# Altium schematic sheet MCU.SchDoc
size A2
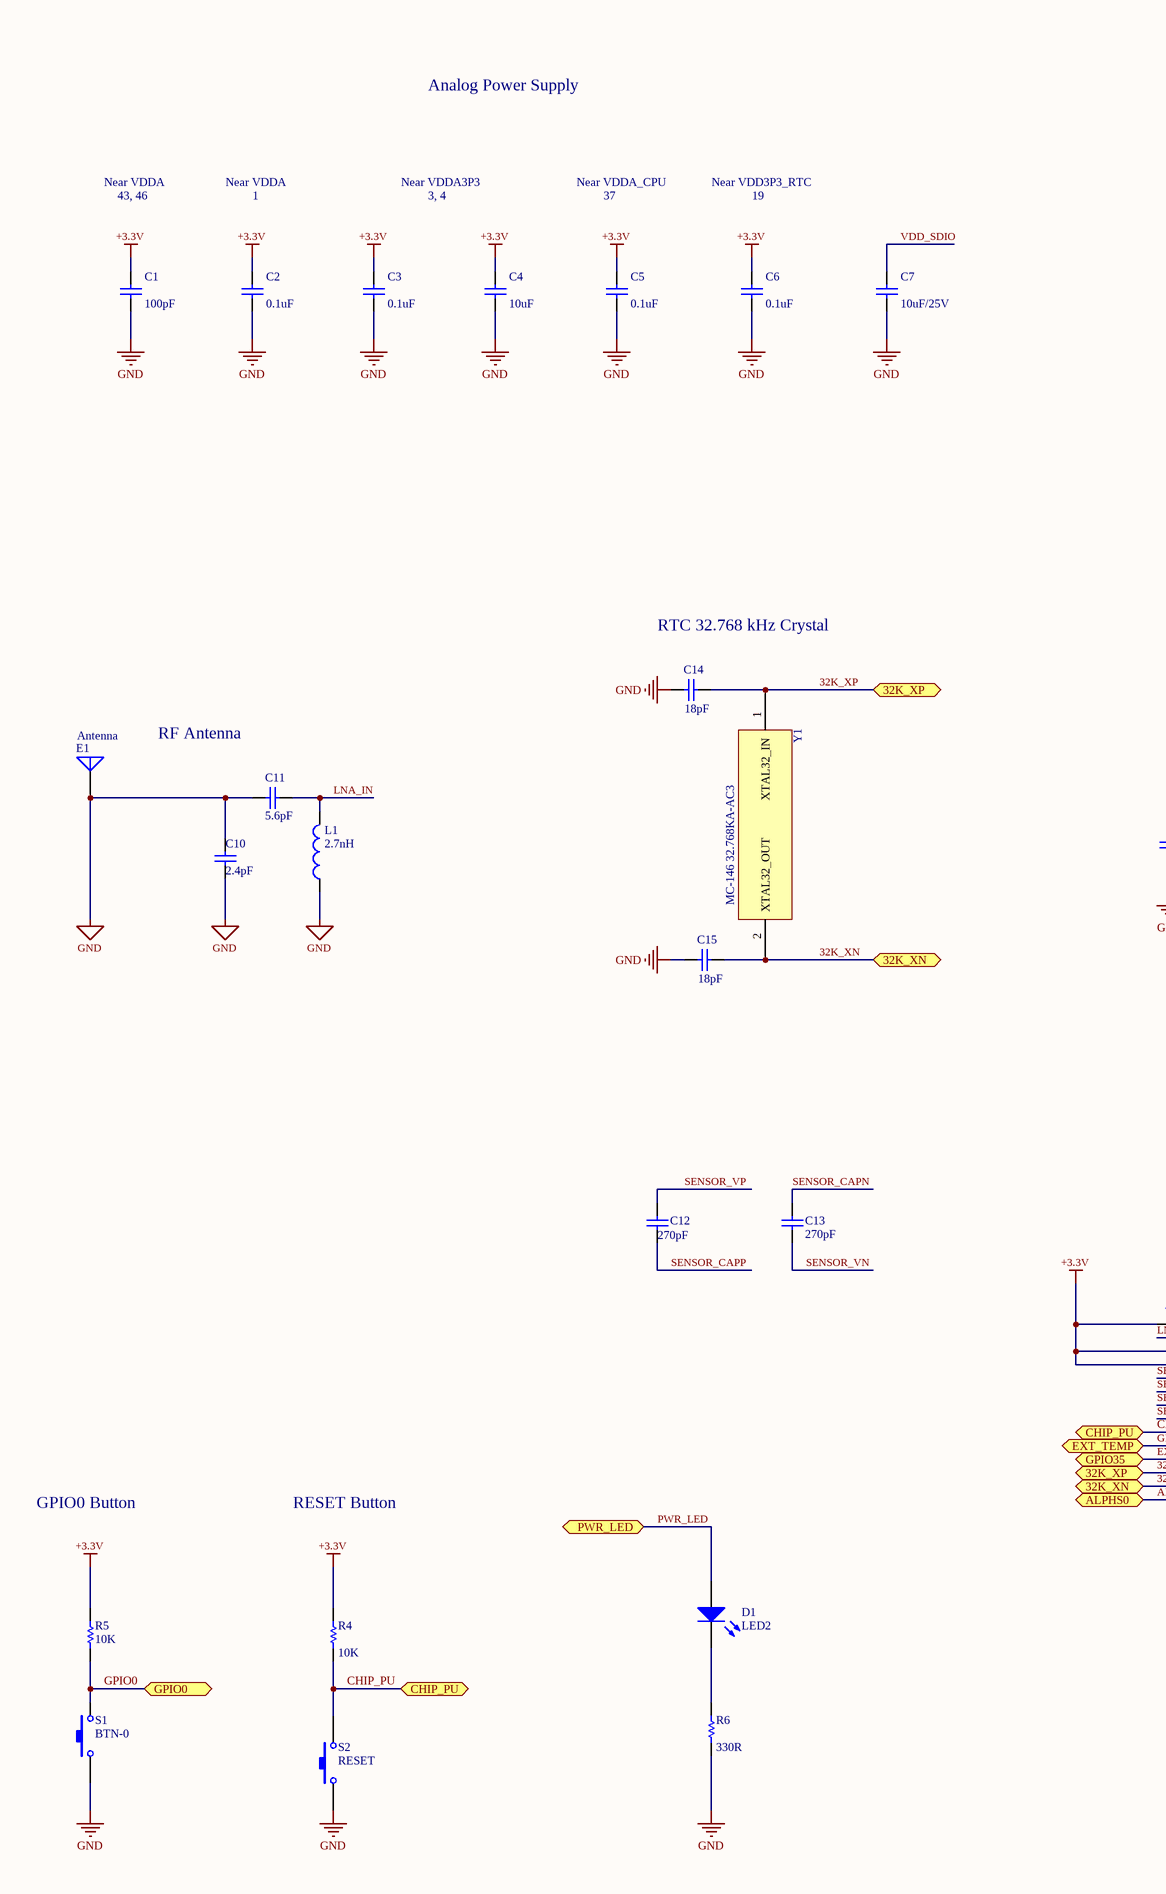
[diagram p0: MCU.SchDoc, left]
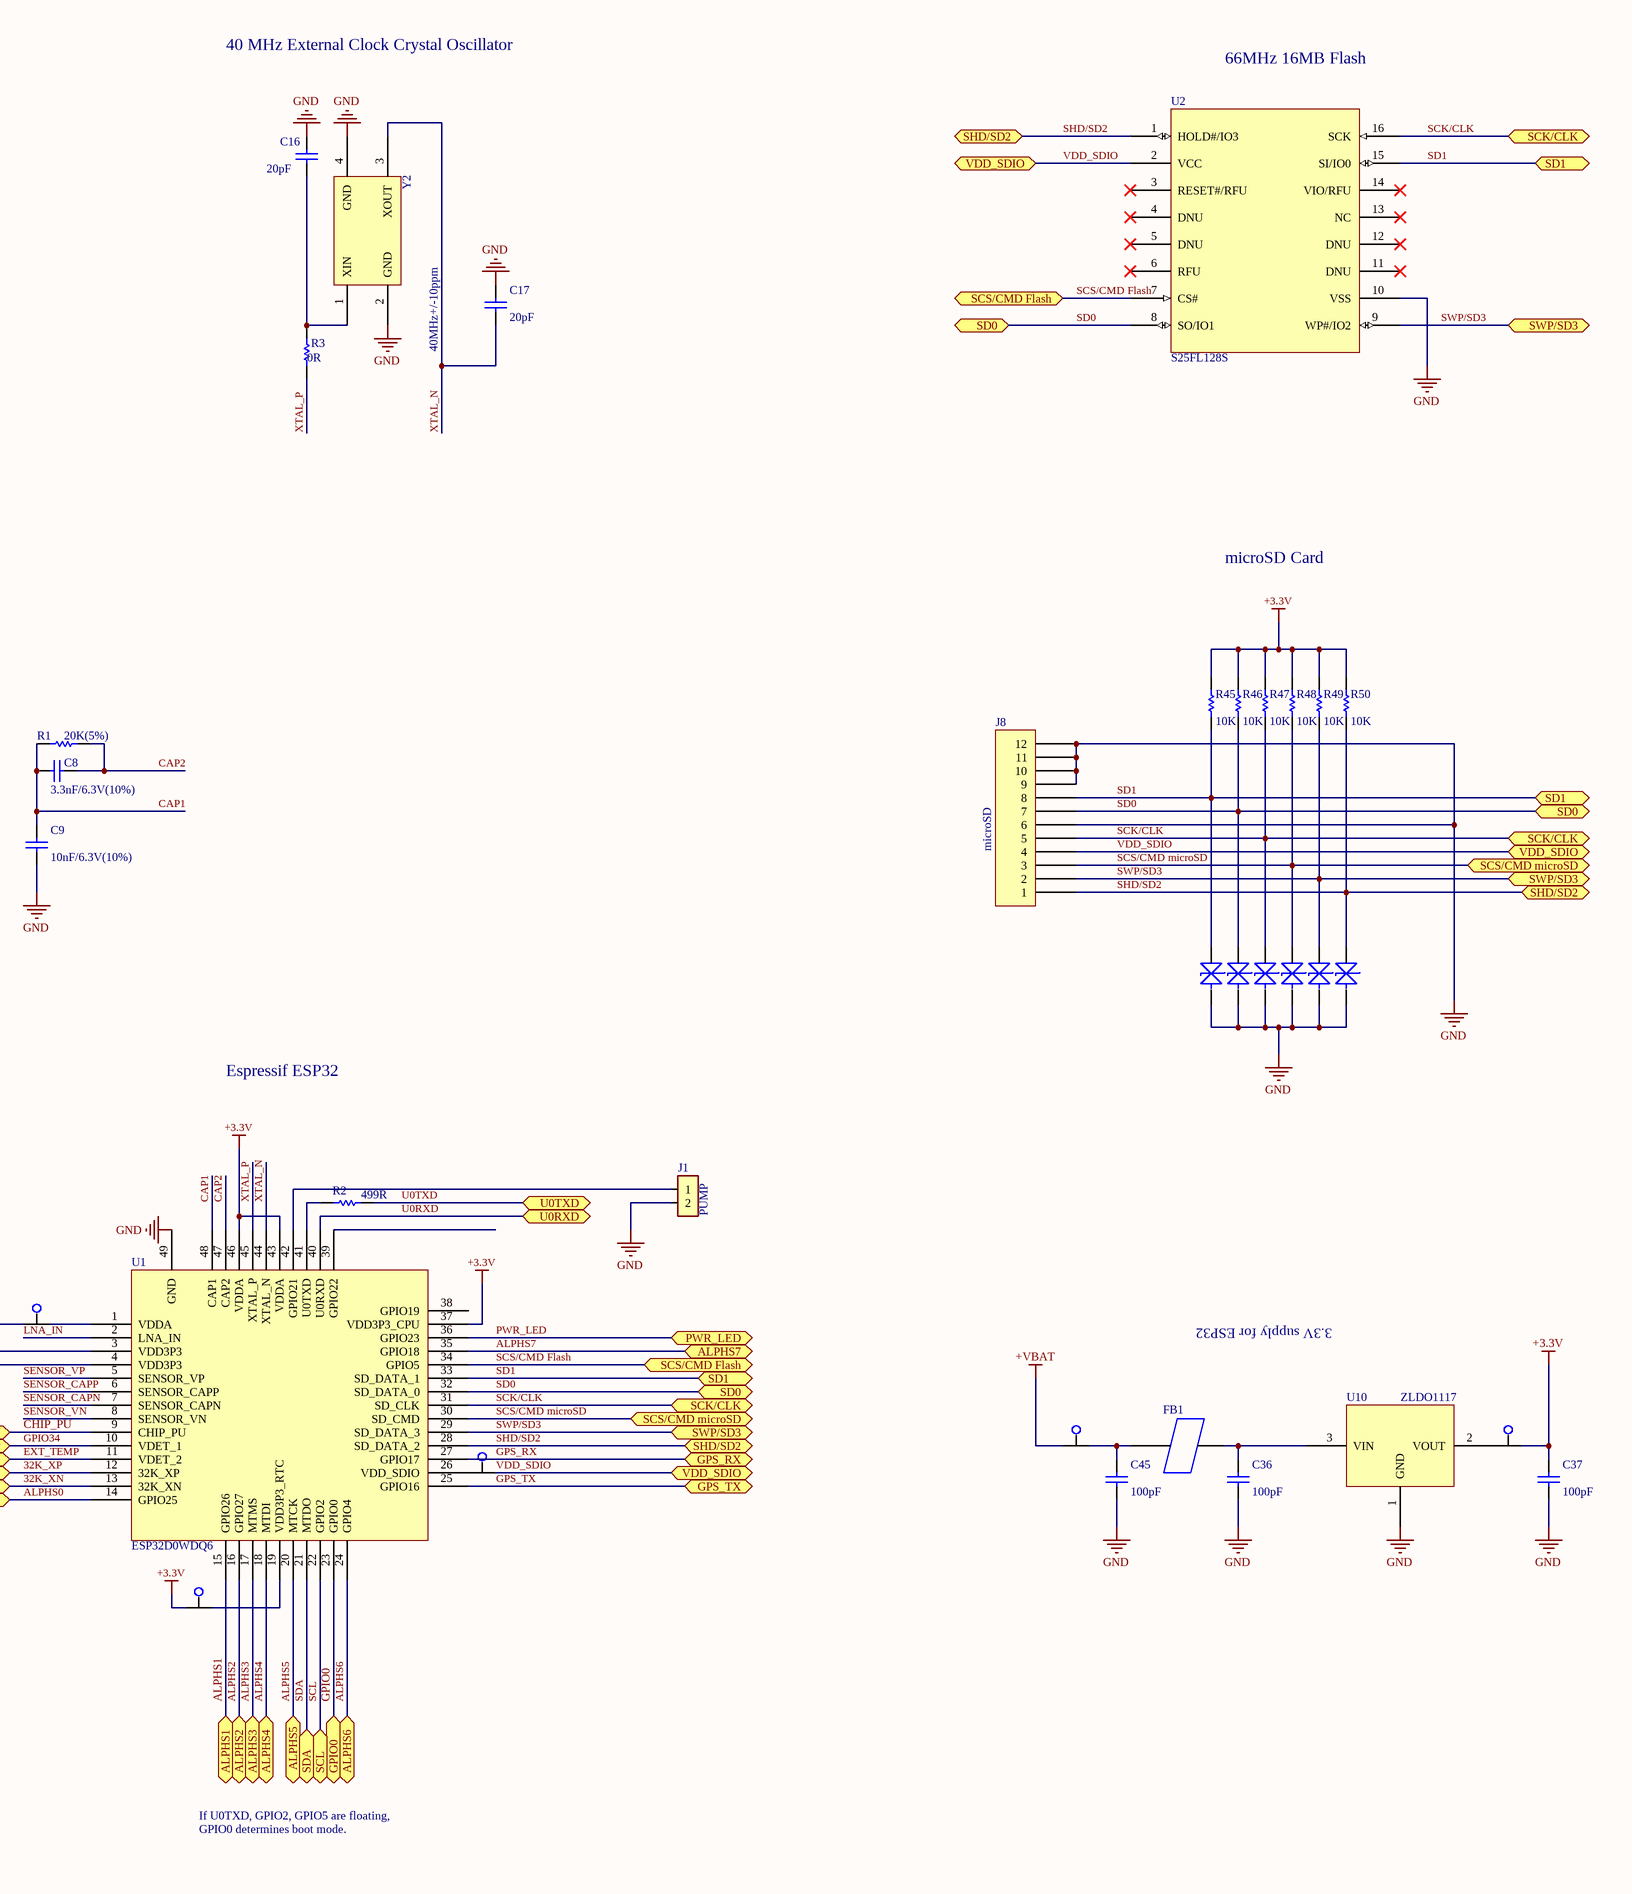
[diagram p1: MCU.SchDoc, right]

## Parts
C1  value 100pF  [1608[0603]]  (hidden comment: Cap)
C2  value 0.1uF  [1608[0603]]  (hidden comment: Cap)
C3  value 0.1uF  [1608[0603]]  (hidden comment: Cap)
C4  value 10uF  [1608[0603]]  (hidden comment: Cap)
C5  value 0.1uF  [1608[0603]]  (hidden comment: Cap)
C6  value 0.1uF  [1608[0603]]  (hidden comment: Cap)
C7  value 10uF/25V  [1608[0603]]  (hidden comment: Cap)
C8  value 3.3nF/6.3V(10%)  [1608[0603]]  (hidden comment: Cap)
C9  value 10nF/6.3V(10%)  [1608[0603]]  (hidden comment: Cap)
C10  value 2.4pF  [1608[0603]]  (hidden comment: Cap)
C11  value 5.6pF  [1608[0603]]  (hidden comment: Cap)
C12  value 270pF  [1608[0603]]  (hidden comment: Cap)
C13  value 270pF  [1608[0603]]  (hidden comment: Cap)
C14  value 18pF  [1608[0603]]  (hidden comment: Cap)
C15  value 18pF  [1608[0603]]  (hidden comment: Cap)
C16  value 20pF  [1608[0603]]  (hidden comment: Cap)
C17  value 20pF  [1608[0603]]  (hidden comment: Cap)
C36  value 100pF  [1608[0603]]  (hidden comment: Cap)
C37  value 100pF  [1608[0603]]  (hidden comment: Cap)
C45  value 100pF  [1608[0603]]  (hidden comment: Cap)
D1  LED2  [3.2X1.6X1.1]
D4  ESD7951ST5GOSCT-ND  [SODFL100X40-2N]  (value not drawn)
D5  ESD7951ST5GOSCT-ND  [SODFL100X40-2N]  (value not drawn)
D6  ESD7951ST5GOSCT-ND  [SODFL100X40-2N]  (value not drawn)
D7  ESD7951ST5GOSCT-ND  [SODFL100X40-2N]  (value not drawn)
D8  ESD7951ST5GOSCT-ND  [SODFL100X40-2N]  (value not drawn)
D9  ESD7951ST5GOSCT-ND  [SODFL100X40-2N]  (value not drawn)
E1  Antenna  [SWRA1117]
FB1  Ferrite Bead  [MI0805K400R-10]  (value not drawn)
J1  PUMP  [6410/2pin]
J8  microSD  [SD-47219-001]
L1  value 2.7nH  [INDC1608L]  (hidden comment: Inductor)
R1  value 20K(5%)  [6-0805_N]  (hidden comment: Res1)
R2  value 499R  [6-0805_L]  (hidden comment: Res1)
R3  value 0R  [6-0805_N]  (hidden comment: Res1)
R4  value 10K  [6-0805_N]  (hidden comment: Res1)
R5  value 10K  [6-0805_N]  (hidden comment: Res1)
R6  value 330R  [6-0805_N]  (hidden comment: Res1)
R45  value 10K  [6-0805_N]  (hidden comment: Res1)
R46  value 10K  [6-0805_N]  (hidden comment: Res1)
R47  value 10K  [6-0805_N]  (hidden comment: Res1)
R48  value 10K  [6-0805_N]  (hidden comment: Res1)
R49  value 10K  [6-0805_N]  (hidden comment: Res1)
R50  value 10K  [6-0805_N]  (hidden comment: Res1)
S1  BTN-0  [SPST-2]
S2  RESET  [SPST-2]
TP14  Hook Type Test Point  [36-500x-ND]  (value not drawn)
TP15  Hook Type Test Point  [36-500x-ND]  (value not drawn)
TP22  Hook Type Test Point  [36-500x-ND]  (value not drawn)
TP23  Hook Type Test Point  [36-500x-ND]  (value not drawn)
TP24  Hook Type Test Point  [36-500x-ND]  (value not drawn)
U1  ESP32D0WDQ6  [QFN40P600X600X90_HS-49N]
U2  S25FL128S  [SOIC127P1030X265-16N]
U10  ZLDO1117  [SOT230P700X165-4N]
Y1  MC-146 32.768KA-AC3  [MC-146]
Y2  FA-20H  [FA-20H]  (value not drawn)

## Ports
32K_XN, 32K_XP, ALPHS0, ALPHS1, ALPHS2, ALPHS3, ALPHS4, ALPHS5, ALPHS6, ALPHS7, CHIP_PU, EXT_TEMP, GPIO0, GPIO35, GPS_RX, GPS_TX, PWR_LED, SCK/CLK, SCL, SCS/CMD Flash, SCS/CMD microSD, SD0, SD1, SDA, SHD/SD2, SWP/SD3, U0RXD, U0TXD, VDD_SDIO

## Nets
+3.3V: C1.2 C2.2 C3.2 C4.2 C5.2 C6.2 C37.1 R4.2 R5.2 R45.2 R46.2 R47.2 R48.2 R49.2 R50.2 TP15.2 TP22.1 TP23.1 U1.3(VDD3P3) U1.4(VDD3P3) U1.37(VDD3P3_CPU) U1.43(VDDA) U1.46(VDDA)
+VBAT: TP14.1
GND: C1.1 C2.1 C3.1 C4.1 C5.1 C6.1 C7.1 C9.1 C10.1 C10.2 C11.2 C14.1 C15.1 C16.2 C17.2 C36.1 C37.2 C45.1 D4.1(CATHODE) D5.1(CATHODE) D6.1(CATHODE) D7.1(CATHODE) D8.1(CATHODE) D9.1(CATHODE) E1.1(A) J1.2 J8.6 J8.9 J8.10 J8.11 J8.12 L1.1 R6.1 S1.1 S2.1 U1.49(GND) U2.10(VSS) U10.1(GND) Y2.2(GND) Y2.4(GND)
32K_XN: C15.2 U1.13(32K_XN) Y1.2(XTAL32_OUT) ; port 32K_XN
32K_XP: C14.2 U1.12(32K_XP) Y1.1(XTAL32_IN) ; port 32K_XP
ALPHS0: U1.14(GPIO25) ; port ALPHS0
ALPHS1: U1.15(GPIO26) ; port ALPHS1
ALPHS2: U1.16(GPIO27) ; port ALPHS2
ALPHS3: U1.17(MTMS) ; port ALPHS3
ALPHS4: U1.18(MTDI) ; port ALPHS4
ALPHS5: U1.20(MTCK) ; port ALPHS5
ALPHS6: U1.24(GPIO4) ; port ALPHS6
ALPHS7: U1.35(GPIO18) ; port ALPHS7
CAP1: C8.2 C9.2 R1.1 U1.48(CAP1)
CAP2: C8.1 R1.2 U1.47(CAP2)
CHIP_PU: R4.1 S2.2 U1.9(CHIP_PU) ; port CHIP_PU
EXT_TEMP: U1.11(VDET_2) ; port GPIO35
GPIO0: R5.1 S1.2 U1.23(GPIO0) ; port GPIO0
GPIO34: U1.10(VDET_1) ; port EXT_TEMP
GPS_RX: U1.27(GPIO17) ; port GPS_RX
GPS_TX: U1.25(GPIO16) ; port GPS_TX
LNA_IN: C11.1 L1.2 U1.2(LNA_IN)
PWR_LED: D1.1(A) U1.36(GPIO23) ; port PWR_LED
SCK/CLK: D6.2(ANODE) J8.5 R47.1 U1.31(SD_CLK) U2.16(SCK) ; port SCK/CLK
SCL: U1.22(GPIO2) ; port SCL
SCS/CMD Flash: U1.34(GPIO5) U2.7(CS#) ; port SCS/CMD Flash
SCS/CMD microSD: D7.2(ANODE) J8.3 R48.1 U1.30(SD_CMD) ; port SCS/CMD microSD
SD0: D5.2(ANODE) J8.7 R46.1 U1.32(SD_DATA_0) U2.8(SO/IO1) ; port SD0
SD1: D4.2(ANODE) J8.8 R45.1 U1.33(SD_DATA_1) U2.15(SI/IO0) ; port SD1
SDA: U1.21(MTDO) ; port SDA
SENSOR_CAPN: C13.1 U1.7(SENSOR_CAPN)
SENSOR_CAPP: C12.1 U1.6(SENSOR_CAPP)
SENSOR_VN: C13.2 U1.8(SENSOR_VN)
SENSOR_VP: C12.2 U1.5(SENSOR_VP)
SHD/SD2: D9.2(ANODE) J8.1 R50.1 U1.28(SD_DATA_2) U2.1(HOLD#/IO3) ; port SHD/SD2
SWP/SD3: D8.2(ANODE) J8.2 R49.1 U1.29(SD_DATA_3) U2.9(WP#/IO2) ; port SWP/SD3
U0RXD: U1.40(U0RXD) ; port U0RXD
U0TXD: R2.2 ; port U0TXD
VDD_SDIO: C7.2 J8.4 TP24.2 U2.2(VCC) ; port VDD_SDIO
XTAL_N: C17.1 U1.44(XTAL_N) Y2.3(XOUT)
XTAL_P: R3.1 U1.45(XTAL_P)
NetC16_1: C16.1 R3.2 Y2.1(XIN)
NetC36_2: C36.2 FB1.2 U10.3(VIN)
NetC45_2: C45.2 FB1.1 TP14.2
NetD1_2: D1.2(K) R6.2
NetJ1_1: J1.1 U1.42(GPIO21)
NetR2_1: R2.1 U1.41(U0TXD)
NetTP15_1: TP15.1 U10.2(VOUT)
NetTP22_2: TP22.2 U1.1(VDDA)
NetTP23_2: TP23.2 U1.19(VDD3P3_RTC)
NetTP24_1: TP24.1 U1.26(VDD_SDIO)

Not connected (* = marked no-connect by the designer): U1 38(GPIO19) 39(GPIO22); U2 3(RESET#/RFU)* 4(DNU)* 5(DNU)* 6(RFU)* 11(DNU)* 12(DNU)* 13(NC)* 14(VIO/RFU)*

## Notes on the sheet
- 40 MHz External Clock Crystal Oscillator
- Analog Power Supply
- 66MHz 16MB Flash
- Near VDDA
- Near VDDA3P3
- Near VDDA_CPU
- Near VDD3P3_RTC
- 43, 46
- 1
- 3, 4
- 37
- 19
- 40MHz+/-10ppm
- microSD Card
- RTC 32.768 kHz Crystal
- RF Antenna
- Espressif ESP32
- 3.3V supply for ESP32
- GPIO0 Button
- RESET Button
- If U0TXD, GPIO2, GPIO5 are floating,
- GPIO0 determines boot mode.

## Library data of the parts
C1-C17 C36 C37 C45 = Cap: Capacitor; Published: 8-Jun-2000; LatestRevisionDate: 17-Jul-2002; LatestRevisionNote: Re-released for DXP Platform.; PackageReference: RAD-0.3; Publisher: Altium Limited; PackageDescription: Radial Cap, Thru-Hole; 2 Leads; 0.3 in Pin Spacing
  C10: Supplier Link: 490-11257-1-ND
  C11: Supplier Link: 490-7162-1-ND
D1 = LED2: Typical RED, GREEN, YELLOW, AMBER GaAs LED; Published: 8-Jun-2000; LatestRevisionDate: 17-Jul-2002; LatestRevisionNote: Re-released for DXP Platform.; PackageVersion: Feb-2002; PackageReference: 3.2X1.6X1.1; Publisher: Altium Limited; PackageDescription: SM LED; 2 Flat Leads
D4-D9 = ESD7951S: TVS Diode; Supplier Link: ESD7951ST5GOSCT-ND
E1 = Antenna: Generic Antenna; Published: 24-Mar-1999; LatestRevisionDate: 17-Jul-2002; LatestRevisionNote: Re-released for DXP Platform.; PackageReference: PIN1; Publisher: Altium Limited
FB1 = Ferrite Bead: MI0805K400R-10; Supplier Link: 240-2389-1-ND
J1 = CON2: Connector 2 pin; Value: *; Type: *; Mfg.: *; Supplier: *; Part#: *; Price: *; Notes: *
J8 = CON12
L1 = Inductor: Code_IEC: 1005; Published: 8-Jun-2000; LatestRevisionDate: 29-May-2009; LatestRevisionNote: IPC-7351 Footprint Added.; PackageReference: 0402-A; Publisher: Altium Limited; PackageDescription: Chip Inductor; Code_JEITA: 0402; Supplier Link: 490-1103-1-ND
R1-R6 R45-R50 = Res1: Resistor; Published: 8-Jun-2000; LatestRevisionDate: 17-Jul-2002; LatestRevisionNote: Re-released for DXP Platform.; PackageReference: AXIAL-0.3; Publisher: Altium Limited; PackageDescription: Axial Device, Thru-Hole; 2 Leads; 0.3 in Pin Spacing
S1 S2 = SW-PB: Switch; Published: 24-Mar-1999; LatestRevisionDate: 17-Jul-2002; LatestRevisionNote: Re-released for DXP Platform.; PackageReference: SPST-2; Publisher: Altium Limited; PackageDescription: Switch; 2 Leads
U1 = ESP32: Microcontroller
U2 = S25FL128S: QSPI 128M Flash Memory
U10 = ZLDO1117: Linear Regulator 1A
Y1 = MC-146 32.768KA-AC3: 32.768 kHz Crystal
Y2 = Y1: 40MHz Crystal Oscillator; Supplier Link: SER4045CT-ND
TP14 TP15 TP22-TP24 = Hook Type Test Point: Supplier Link: 36-500x-ND